# Altium schematic sheet Drv8301.SchDoc
size A4
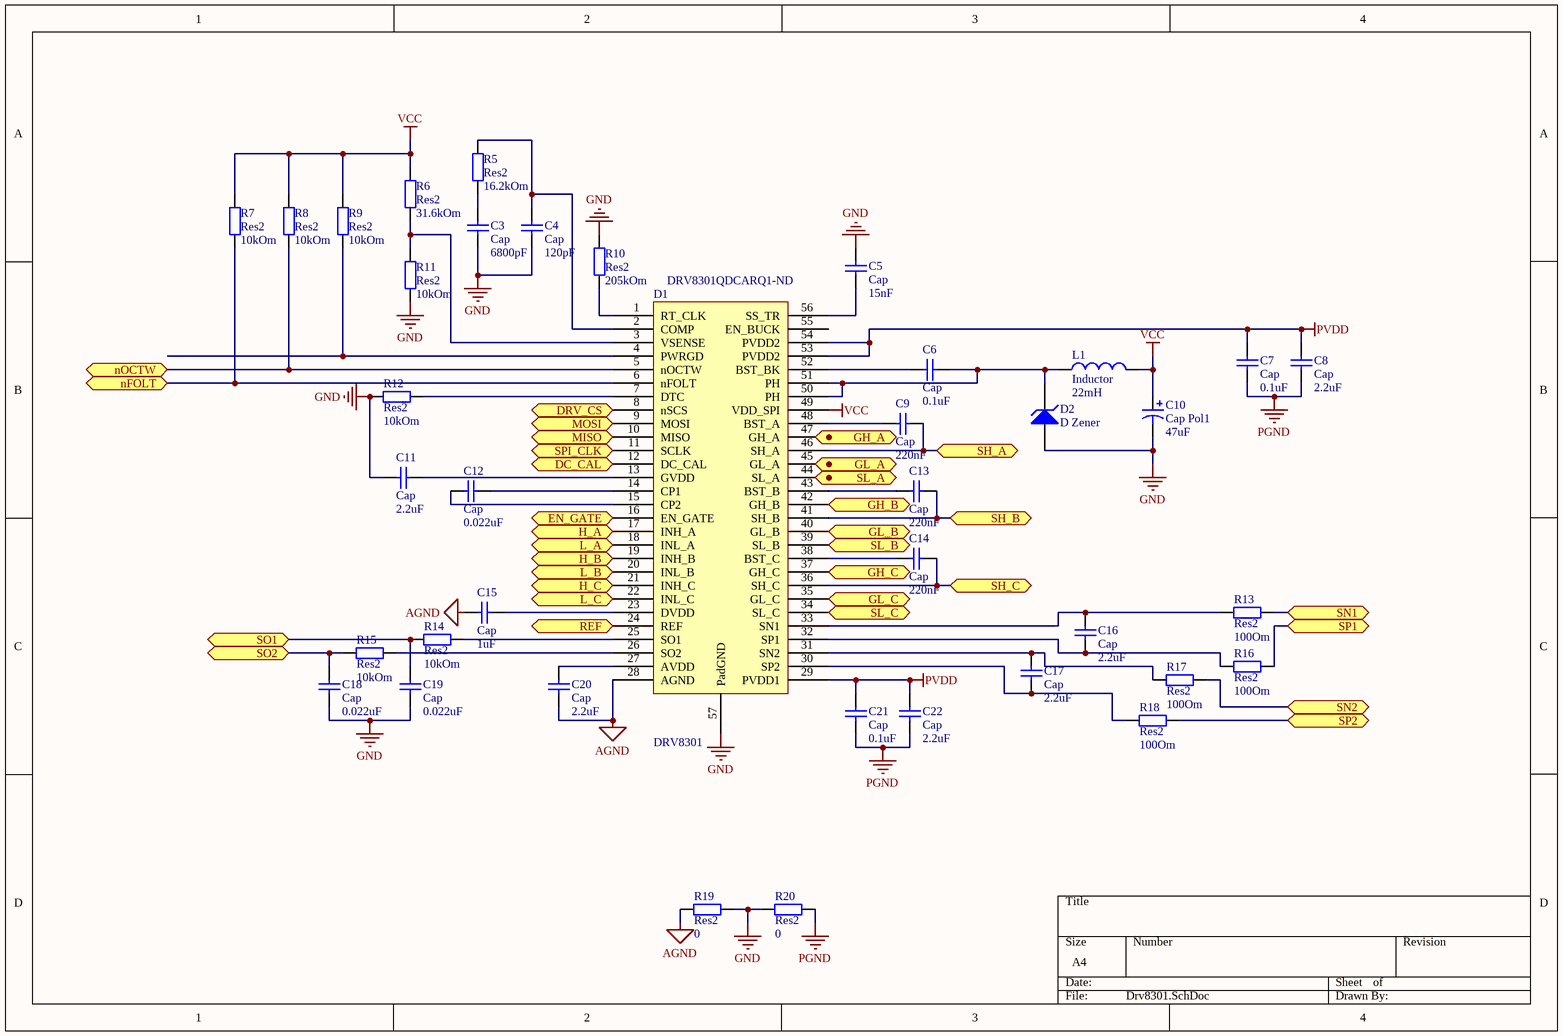
[diagram p0: Drv8301.SchDoc]

## Parts
C3  Cap  value 6800pF  [6-0805_N]
C4  Cap  value 120pF  [6-0805_N]
C5  Cap  value 15nF  [6-0805_N]
C6  Cap  value 0.1uF  [6-0805_N]
C7  Cap  value 0.1uF  [C1206]
C8  Cap  value 2.2uF  [C1206]
C9  Cap  value 220nF  [RAD-0.3]
C10  Cap Pol1  value 47uF  [C1210_N]
C11  Cap  value 2.2uF  [C1210_N]
C12  Cap  value 0.022uF  [6-0805_N]
C13  Cap  value 220nF  [RAD-0.3]
C14  Cap  value 220nF  [RAD-0.3]
C15  Cap  value 1uF  [6-0805_N]
C16  Cap  value 2.2uF  [6-0805_N]
C17  Cap  value 2.2uF  [6-0805_N]
C18  Cap  value 0.022uF  [6-0805_N]
C19  Cap  value 0.022uF  [6-0805_N]
C20  Cap  value 2.2uF  [6-0805_N]
C21  Cap  value 0.1uF  [C1206]
C22  Cap  value 2.2uF  [C1206]
D1  DRV8301  Supplier Part Number 1: DRV8301QDCARQ1-ND  [HTSSOP56]
D2  D Zener  [SMB]
L1  Inductor  value 22mH  [INDC4532]
R5  Res2  value 16.2kOm  [6-0805_N]
R6  Res2  value 31.6kOm  [6-0805_N]
R7  Res2  value 10kOm  [6-0805_N]
R8  Res2  value 10kOm  [6-0805_N]
R9  Res2  value 10kOm  [6-0805_N]
R10  Res2  value 205kOm  [6-0805_N]
R11  Res2  value 10kOm  [6-0805_N]
R12  Res2  value 10kOm  [6-0805_N]
R13  Res2  value 100Om  [6-0805_N]
R14  Res2  value 10kOm  [6-0805_N]
R15  Res2  value 10kOm  [6-0805_N]
R16  Res2  value 100Om  [6-0805_N]
R17  Res2  value 100Om  [6-0805_N]
R18  Res2  value 100Om  [6-0805_N]
R19  Res2  value 0  [6-0805_N]
R20  Res2  value 0  [6-0805_N]

## Ports
DC_CAL, DRV_CS, EN_GATE, GH_A, GH_B, GH_C, GL_A, GL_B, GL_C, H_A, H_B, H_C, L_A, L_B, L_C, MISO, MOSI, nFOLT, nOCTW, REF, SH_A, SH_B, SH_C, SL_A, SL_B, SL_C, SN1, SN2, SO1, SO2, SP1, SP2, SPI_CLK

## Nets
AGND: C15.1 C20.1 D1.28(AGND) R19.1
GND: C3.2 C4.2 C5.1 C10.2 C11.1 C18.1 C19.1 D1.57(PadGND) D2.1(A) R10.2 R11.1 R12.2 R19.2 R20.1
PGND: C7.1 C8.1 C21.1 C22.1 R20.2
PVDD: C7.2 C8.2 C21.2 C22.2 D1.29(PVDD1) D1.53(PVDD2) D1.54(PVDD2)
VCC: C10.1 D1.49(VDD_SPI) L1.2 R6.2 R7.2 R8.2 R9.2
DC_CAL: D1.12(DC_CAL) ; port DC_CAL
DRV_CS: D1.8(nSCS) ; port DRV_CS
EN_GATE: D1.16(EN_GATE) ; port EN_GATE
GH_B: D1.42(GH_B) ; port GH_B
GH_C: D1.37(GH_C) ; port GH_C
GL_B: D1.40(GL_B) ; port GL_B
GL_C: D1.35(GL_C) ; port GL_C
H_A: D1.17(INH_A) ; port H_A
H_B: D1.19(INH_B) ; port H_B
H_C: D1.21(INH_C) ; port H_C
L_A: D1.18(INL_A) ; port L_A
L_B: D1.20(INL_B) ; port L_B
L_C: D1.22(INL_C) ; port L_C
MISO: D1.10(MISO) ; port MISO
MOSI: D1.9(MOSI) ; port MOSI
nFOLT: D1.6(nFOLT) R7.1 ; port nFOLT
nOCTW: D1.5(nOCTW) R8.1 ; port nOCTW
REF: D1.24(REF) ; port REF
SH_A: C9.1 D1.46(SH_A) ; port SH_A
SH_B: C13.1 D1.41(SH_B) ; port SH_B
SH_C: C14.1 D1.36(SH_C) ; port SH_C
SL_B: D1.39(SL_B) ; port SL_B
SL_C: D1.34(SL_C) ; port SL_C
SN1: R13.1 ; port SN1
SN2: R17.1 ; port SN2
SO1: C19.2 R14.2 ; port SO1
SO2: C18.2 R15.2 ; port SO2
SP1: R16.1 ; port SP1
SP2: R18.1 ; port SP2
SPI_CLK: D1.11(SCLK) ; port SPI_CLK
NetC3_1: C3.1 R5.1
NetC4_1: C4.1 D1.2(COMP) R5.2
NetC5_2: C5.2 D1.56(SS_TR)
NetC6_1: C6.1 D1.50(PH) D1.51(PH) D2.2(K) L1.1
NetC6_2: C6.2 D1.52(BST_BK)
NetC9_2: C9.2 D1.48(BST_A)
NetC11_2: C11.2 D1.13(GVDD)
NetC12_1: C12.1 D1.15(CP2)
NetC12_2: C12.2 D1.14(CP1)
NetC13_2: C13.2 D1.43(BST_B)
NetC14_2: C14.2 D1.38(BST_C)
NetC15_2: C15.2 D1.23(DVDD)
NetC16_1: C16.1 D1.32(SP1) R16.2
NetC16_2: C16.2 D1.33(SN1) R13.2
NetC17_1: C17.1 D1.30(SP2) R18.2
NetC17_2: C17.2 D1.31(SN2) R17.2
NetC20_2: C20.2 D1.27(AVDD)
NetD1_1: D1.1(RT_CLK) R10.1
NetD1_3: D1.3(VSENSE) R6.1 R11.2
NetD1_4: D1.4(PWRGD) R9.1
NetD1_7: D1.7(DTC) R12.1
NetD1_25: D1.25(SO1) R14.1
NetD1_26: D1.26(SO2) R15.1

Not connected (* = marked no-connect by the designer): D1 44(SL_A) 45(GL_A) 47(GH_A) 55(EN_BUCK)

## Library data of the parts
C3-C9 C11-C21 = Cap: Capacitor; Published: 8-Jun-2000; LatestRevisionDate: 17-Jul-2002; LatestRevisionNote: Re-released for DXP Platform.; PackageReference: RAD-0.3; Publisher: Altium Limited; PackageDescription: Radial Cap, Thru-Hole; 2 Leads; 0.3 in Pin Spacing
  C12 C21: REF: http://kosmodrom.com.ua/el.php?name=CAP-CERAMIC-Y2-0.01-250
C10 = Cap Pol1: Polarized Capacitor (Radial); Published: 8-Jun-2000; LatestRevisionDate: 17-Jul-2002; LatestRevisionNote: Re-released for DXP Platform.; PackageReference: RB7.6-15; Publisher: Altium Limited; PackageDescription: Polarized Capacitor (Radial); 2 Leads
C22 = Cap: ECAP-NOPOLAR-4,7mkf; Published: 8-Jun-2000; LatestRevisionDate: 17-Jul-2002; LatestRevisionNote: Re-released for DXP Platform.; PackageReference: RAD-0.3; Publisher: Altium Limited; PackageDescription: Radial Cap, Thru-Hole; 2 Leads; 0.3 in Pin Spacing; REF: http://kosmodrom.com.ua/el.php?name=ECAP4.7MKF100VNP5X11
D1 = DRV8301: DRV8301 Three-Phase Gate Driver With Dual Current Shunt Amplifiers  and Buck Regulator; Supplier 1: Digi-Key
D2 = D Zener: Zener Diode; Published: 8-Jun-2000; LatestRevisionDate: 17-Jul-2002; LatestRevisionNote: Re-released for DXP Platform.; PackageReference: DIODE-0.7; Publisher: Altium Limited; PackageDescription: Diode, Thru-Hole; 2 Leads; 0.7 in Pin Spacing
L1 = Inductor: Code_IEC: 1005; Published: 8-Jun-2000; LatestRevisionDate: 29-May-2009; LatestRevisionNote: IPC-7351 Footprint Added.; PackageReference: 0402-A; Publisher: Altium Limited; PackageDescription: Chip Inductor; Code_JEITA: 0402
R5-R20 = Res2: Resistor; Published: 8-Jun-2000; LatestRevisionDate: 17-Jul-2002; LatestRevisionNote: Re-released for DXP Platform.; PackageReference: AXIAL-0.4; Publisher: Altium Limited; PackageDescription: Axial Device, Thru-Hole; 2 Leads; 0.4 in Pin Spacing